# EasyEDA Pro project ProPrj_T113最小系统(最简)_2026-08-06.epro, schematic Schematic1

## Sheets
1 P1: Board Name: Board1; Create Date: 2026-06-25; Page Name: P1; Project Name: T113最小系统(最简); Schematic Name: Schematic1; Update Date: 2026-07-01; Company: 嘉立创EDA; Page Size: A4; Version: V1.0
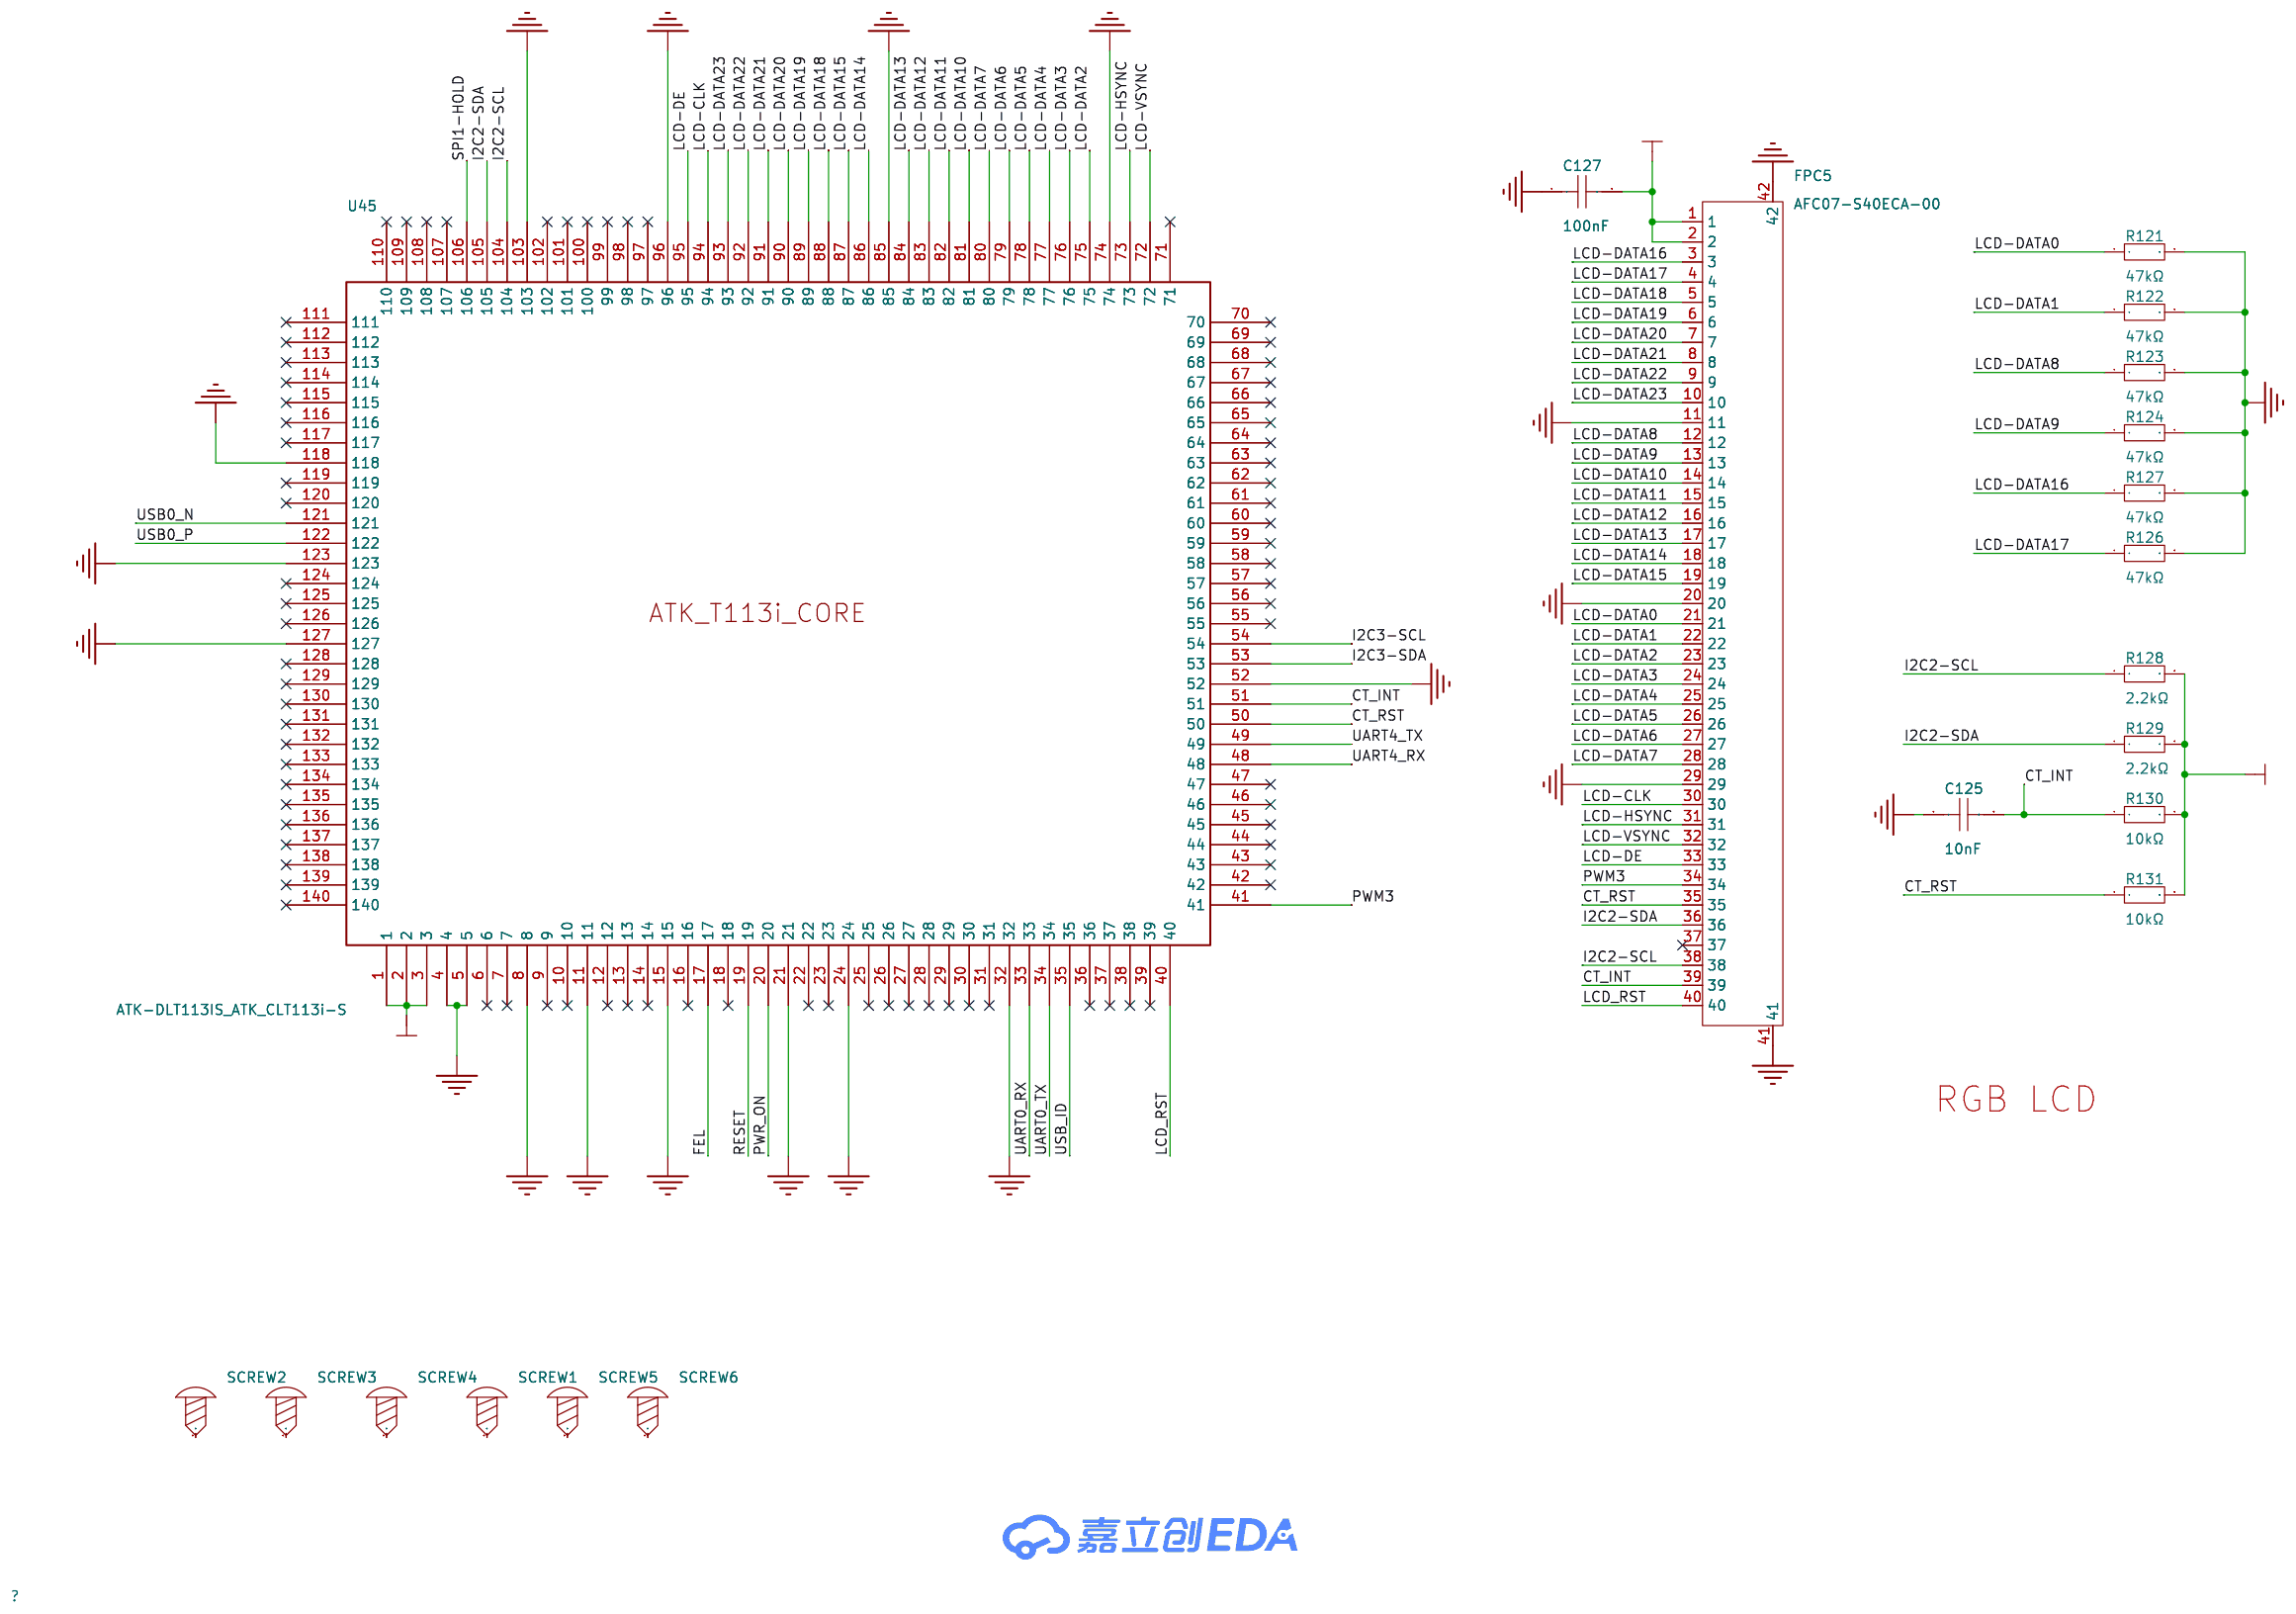
[diagram p0: P1]
2 P4: Page Name: P4; Update Date: 2026-06-25
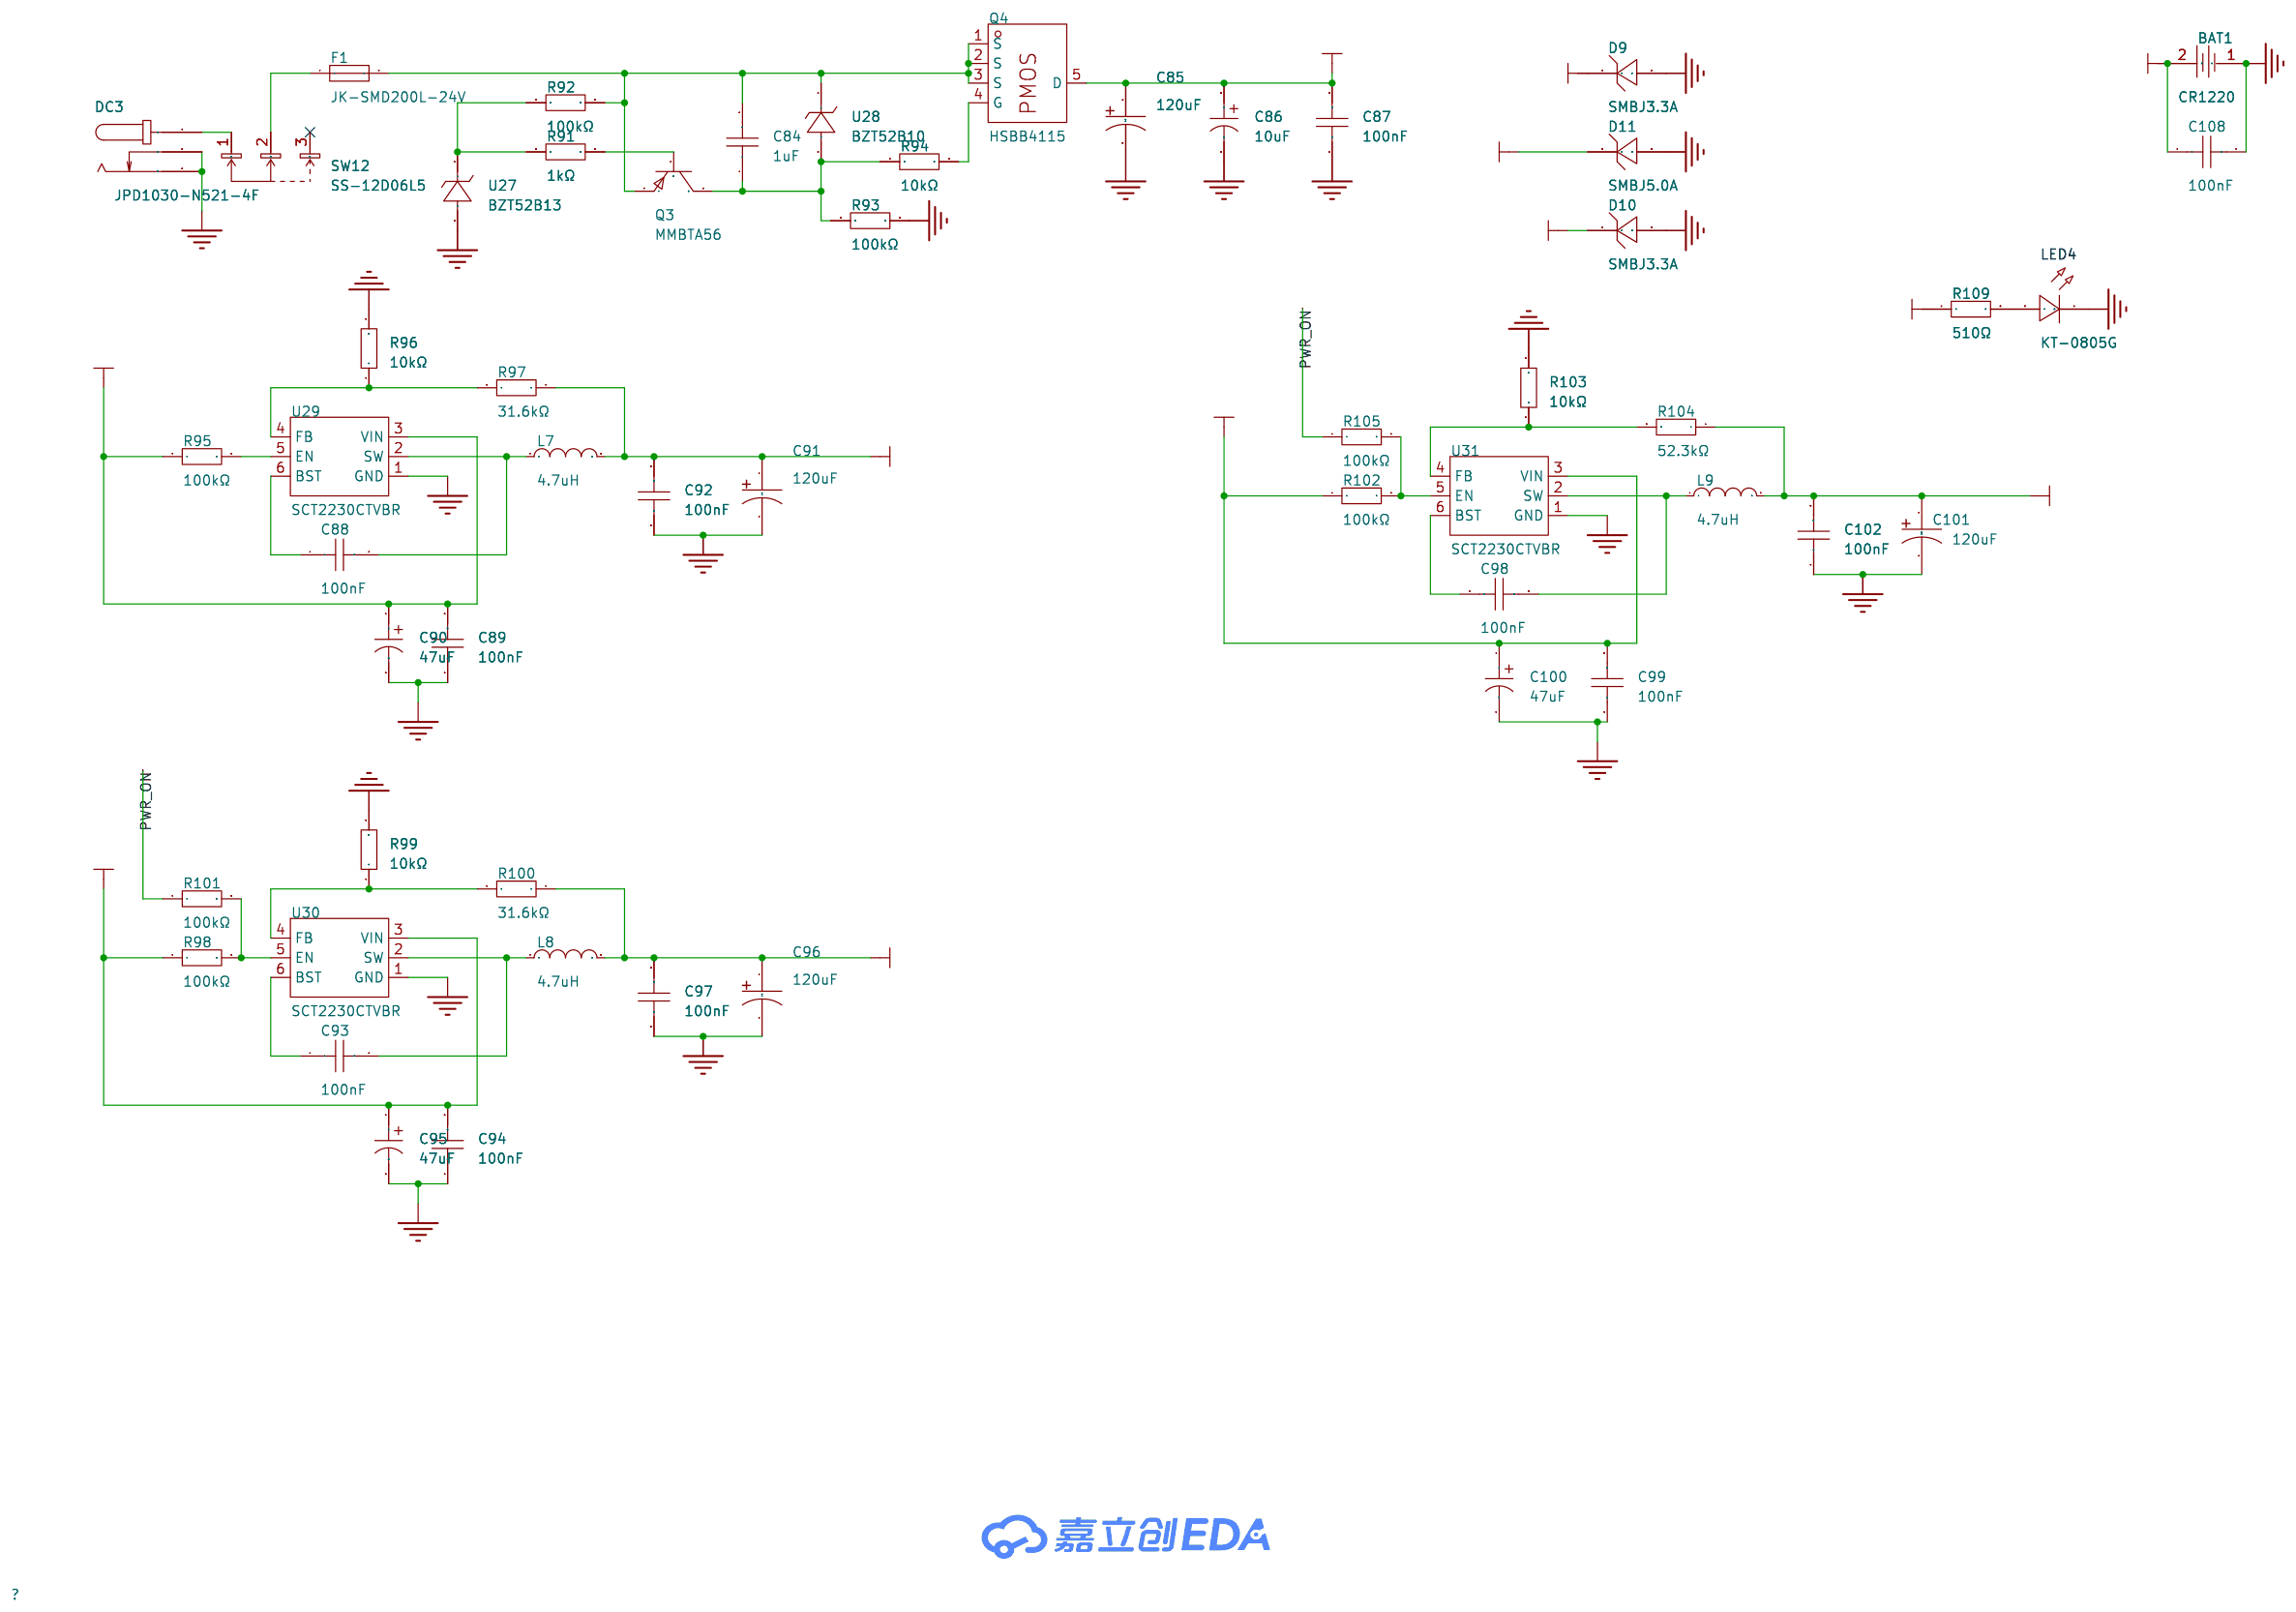
[diagram p1: P4]
3 P5: Page Name: P5; Update Date: 2026-06-25
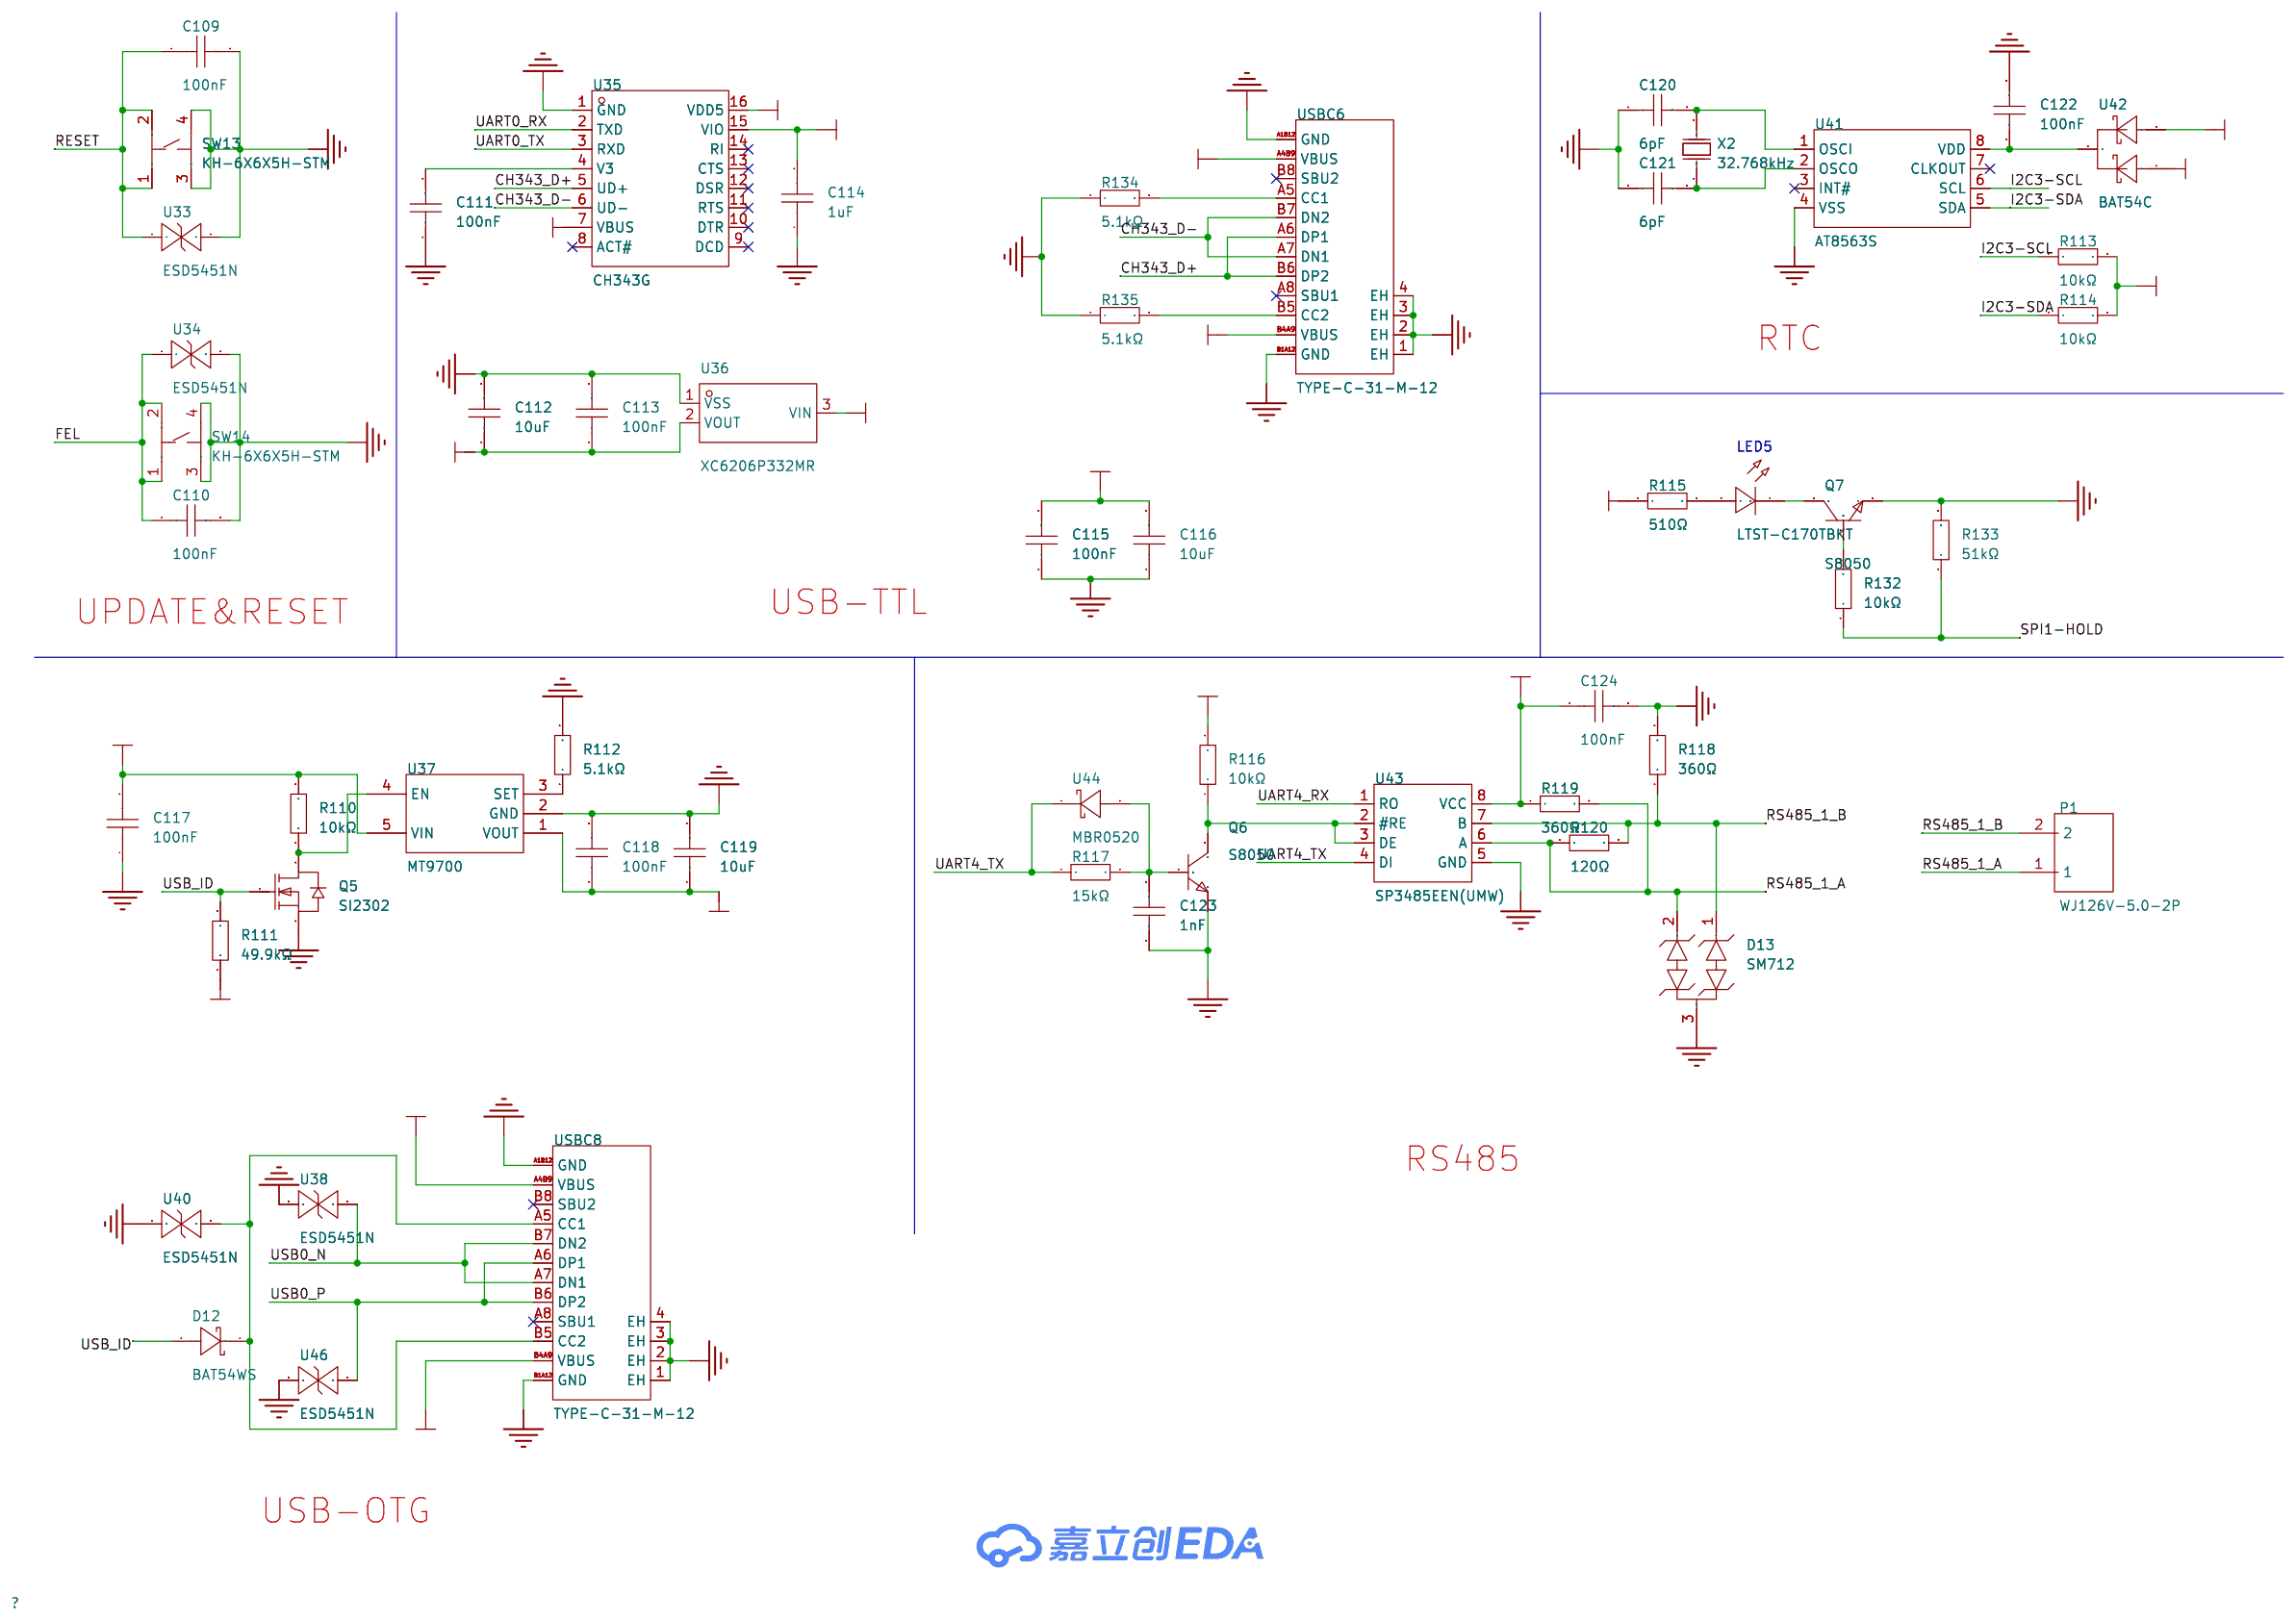
[diagram p2: P5]

## Parts
sheet P1
C125  10nF  [C0805]
C127  100nF  [C0805]
FPC5  AFC07-S40ECA-00  [FPC-SMD_P0.50-40P_LCS-SJ-H2.0]
R121  47kΩ  [R0805]
R122  47kΩ  [R0805]
R123  47kΩ  [R0805]
R124  47kΩ  [R0805]
R126  47kΩ  [R0805]
R127  47kΩ  [R0805]
R128  2.2kΩ  [R0805]
R129  2.2kΩ  [R0805]
R130  10kΩ  [R0805]
R131  10kΩ  [R0805]
SCREW1  -  [M3螺丝]
SCREW2  -  [M3螺丝]
SCREW3  -  [M3螺丝]
SCREW4  -  [M3螺丝]
SCREW5  -  [M3螺丝]
SCREW6  -  [M3螺丝]
U45  ATK_CLT113i-S  [ATK-DLT113IS:ATK_CLT113i_CORE]
sheet P4
BAT1  CR1220  [TH_BD12.5-P12.0-RD-CR1220]
C84  1uF  [C0805]
C85  120uF  [CAP-SMD_BD6.3-L6.6-W6.6-FD]
C86  10uF  [CAP-SMD_BD4.0-L4.3-W4.3-LS5.0-FD]
C87  100nF  [C0805]
C88  100nF  [C0805]
C89  100nF  [C0805]
C90  47uF  [CAP-SMD_BD6.3-L6.6-W6.6-LS7.2-FD]
C91  120uF  [CAP-SMD_BD6.3-L6.6-W6.6-FD]
C92  100nF  [C0805]
C93  100nF  [C0805]
C94  100nF  [C0805]
C95  47uF  [CAP-SMD_BD6.3-L6.6-W6.6-LS7.2-FD]
C96  120uF  [CAP-SMD_BD6.3-L6.6-W6.6-FD]
C97  100nF  [C0805]
C98  100nF  [C0805]
C99  100nF  [C0805]
C100  47uF  [CAP-SMD_BD6.3-L6.6-W6.6-LS7.2-FD]
C101  120uF  [CAP-SMD_BD6.3-L6.6-W6.6-FD]
C102  100nF  [C0805]
C108  100nF  [C0805]
D9  SMBJ3.3A  [SMB_L4.6-W3.6-LS5.3-RD]
D10  SMBJ3.3A  [SMB_L4.6-W3.6-LS5.3-RD]
D11  SMBJ5.0A  [SMB_L4.6-W3.6-LS5.3-RD]
DC3  JPD1030-N521-4F  [DC-IN-TH_JPD1030-N521-4F]
F1  JK-SMD200L-24V  [F2920]
L7  4.7uH  [IND-SMD_L4.6-W4.1-A]
L8  4.7uH  [IND-SMD_L4.6-W4.1-A]
L9  4.7uH  [IND-SMD_L4.6-W4.1-A]
LED4  KT-0805G  [LED0805-R-RD]
Q3  MMBTA56  [SOT-23-3_L2.9-W1.3-P1.90-LS2.4-BL-1]
Q4  HSBB4115  [DFN-8_L3.0-W3.0-P0.65-BL-1]
R91  1kΩ  [R0805]
R92  100kΩ  [R0805]
R93  100kΩ  [R0805]
R94  10kΩ  [R0805]
R95  100kΩ  [R0805]
R96  10kΩ  [R0805]
R97  31.6kΩ  [R0805]
R98  100kΩ  [R0805]
R99  10kΩ  [R0805]
R100  31.6kΩ  [R0805]
R101  100kΩ  [R0805]
R102  100kΩ  [R0805]
R103  10kΩ  [R0805]
R104  52.3kΩ  [R0805]
R105  100kΩ  [R0805]
R109  510Ω  [R0805]
SW12  SS-12D06L5  [SW-TH_3P-P4.70_L11.1-W12.7]
U27  BZT52B13  [SOD-123_L2.7-W1.6-LS3.7-RD]
U28  BZT52B10  [SOD-123_L2.7-W1.6-LS3.7-RD]
U29  SCT2230CTVBR  [TSOT-23-6_L2.9-W1.6-P0.95-LS2.8-BL]
U30  SCT2230CTVBR  [TSOT-23-6_L2.9-W1.6-P0.95-LS2.8-BL]
U31  SCT2230CTVBR  [TSOT-23-6_L2.9-W1.6-P0.95-LS2.8-BL]
sheet P5
C109  100nF  [C0805]
C110  100nF  [C0805]
C111  100nF  [C0805]
C112  10uF  [C0805]
C113  100nF  [C0805]
C114  1uF  [C0805]
C115  100nF  [C0805]
C116  10uF  [C0805]
C117  100nF  [C0805]
C118  100nF  [C0805]
C119  10uF  [C0805]
C120  6pF  [C0805]
C121  6pF  [C0805]
C122  100nF  [C0805]
C123  1nF  [C0805]
C124  100nF  [C0805]
D12  BAT54WS  [SOD-323_L1.7-W1.3-LS2.6-RD-1]
D13  SM712  [SOT-23-3_L2.9-W1.3-P1.90-LS2.4-BR]
LED5  LTST-C170TBKT  [LED0805-RD_BLUE]
P1  WJ126V-5.0-2P  [CONN-TH_WJ126V-5.0-2P]
Q5  SI2302  [SOT-23-3_L2.9-W1.3-P1.90-LS2.4-BR]
Q6  S8050  [SOT-23-3_L2.9-W1.3-P1.90-LS2.3-BR]
Q7  S8050  [SOT-23-3_L2.9-W1.3-P1.90-LS2.4-BR]
R110  10kΩ  [R0805]
R111  49.9kΩ  [R0805]
R112  5.1kΩ  [R0805]
R113  10kΩ  [R0805]
R114  10kΩ  [R0805]
R115  510Ω  [R0805]
R116  10kΩ  [R0805]
R117  15kΩ  [R0805]
R118  360Ω  [R0805]
R119  360Ω  [R0805]
R120  120Ω  [R0805]
R132  10kΩ  [R0805]
R133  51kΩ  [R0805]
R134  5.1kΩ  [R0805]
R135  5.1kΩ  [R0805]
SW13  KH-6X6X5H-STM  [SW-SMD_4P-L6.0-W6.0-P4.50-LS9.0_H5.0]
SW14  KH-6X6X5H-STM  [SW-SMD_4P-L6.0-W6.0-P4.50-LS9.0_H5.0]
U33  ESD5451N  [X1-DFN1006-2_L1.0-W0.6-P0.65-BI]
U34  ESD5451N  [X1-DFN1006-2_L1.0-W0.6-P0.65-BI]
U35  CH343G  [SOP-16_L10.0-W3.9-P1.27-LS6.0-BL]
U36  XC6206P332MR  [SOT-23-3_L3.0-W1.7-P0.95-LS2.9-BR]
U37  MT9700  [SOT-23-5_L3.0-W1.7-P0.95-LS2.8-BR]
U38  ESD5451N  [X1-DFN1006-2_L1.0-W0.6-P0.65-BI]
U40  ESD5451N  [X1-DFN1006-2_L1.0-W0.6-P0.65-BI]
U41  AT8563S  [MSOP-8_L3.0-W3.0-P0.65-LS5.0-BL]
U42  BAT54C  [SOT-23-3_L2.9-W1.3-P1.90-LS2.8-BR]
U43  SP3485EEN(UMW)  [SOP-8_L5.0-W4.0-P1.27-LS6.0-BL]
U44  MBR0520  [SOD-123_L2.7-W1.6-LS3.7-RD-A]
U46  ESD5451N  [X1-DFN1006-2_L1.0-W0.6-P0.65-BI]
USBC6  TYPE-C-31-M-12  [USB-C_SMD-TYPE-C-31-M-12_1]
USBC8  TYPE-C-31-M-12  [USB-C_SMD-TYPE-C-31-M-12_1]
X2  32.768kHz  [CRYSTAL-SMD_L3.2-W1.5-1]

## Library data of the parts
C125 = CL21B103KBANNNC: 容值:10nF;精度:±10%;额定电压:50V;温度系数:X7R;; LCSC Part Name: 10nF ±10% 50V; Supplier Part: C1710; Manufacturer: SAMSUNG(三星); Supplier Footprint: 0805; JLCPCB Part Class: Basic Part; Datasheet: https://item.szlcsc.com/datasheet/CL21B103KBANNNC/2062.html; Supplier: LCSC; Tolerance: ±10%; Voltage Rating: 50V; Temperature Coefficient: X7R
C87-C89 C92-C94 C97-C99 C102 C108-C111 C113 C115 C117 C118 C122 C124 C127 = CC0805KRX7R9BB104: 容值:100nF;精度:±10%;额定电压:50V;温度系数:X7R;; LCSC Part Name: 100nF ±10% 50V; Supplier Part: C49678; Manufacturer: YAGEO(国巨); Supplier Footprint: 0805; JLCPCB Part Class: Basic Part; Datasheet: https://atta.szlcsc.com/upload/public/pdf/source/20180224/C181747_15194369449651363981.pdf; Supplier: LCSC; Tolerance: ±10%; Voltage Rated: 50V; Temperature Coefficient: X7R; Voltage Rating: 50V
FPC5 = AFC07-S40ECA-00: 锁定特性:抽屉式;触点类型:上接;触点数量:40P;间距:0.5mm;安装方式:卧贴;; LCSC Part Name: 间距:0.5mm P数:40P 抽屉式 上接; Supplier Part: C262648; Manufacturer: JS(钜硕电子); Supplier Footprint: SMD,P=0.5mm,卧贴; JLCPCB Part Class: 扩展库; Datasheet: https://item.szlcsc.com/datasheet/AFC07-S40ECA-00/253907.html; Supplier: LCSC; Locking Feature: 抽屉式; Contact Type: 上接; Number of Contacts: 40P; Pitch: 0.5mm; Mounting Type: 卧贴; FFC, FCB Thickness: 0.3mm; Height Above Board: 2mm
R121-R124 R126 R127 = 0805W8F4702T5E: 电阻类型:厚膜电阻;阻值:47kΩ;精度:±1%;功率:125mW;工作电压:150V;温度系数:±100ppm/℃;; LCSC Part Name: 47kΩ ±1% 125mW 厚膜电阻; Supplier Part: C17713; Manufacturer: UNI-ROYAL(厚声); Supplier Footprint: 0805; JLCPCB Part Class: Basic Part; Datasheet: https://item.szlcsc.com/datasheet/0805W8F4702T5E/18401.html; Supplier: LCSC; Type: 厚膜电阻; Tolerance: ±1%; Power(Watts): 125mW; Voltage-Supply(Max): 150V; Temperature Coefficient: ±100ppm/℃; Operating Temperature: -55℃~+155℃
R128 R129 = 0805W8F2201T5E: 电阻类型:厚膜电阻;阻值:2.2kΩ;精度:±1%;功率:125mW;工作电压:150V;温度系数:±100ppm/℃;; LCSC Part Name: 2.2kΩ ±1% 125mW 厚膜电阻; Supplier Part: C17520; Manufacturer: UNI-ROYAL(厚声); Supplier Footprint: 0805; JLCPCB Part Class: Basic Part; Datasheet: https://item.szlcsc.com/datasheet/0805W8F2201T5E/18208.html; Supplier: LCSC; Type: 厚膜电阻; Tolerance: ±1%; Power(Watts): 125mW; Voltage-Supply(Max): 150V; Temperature Coefficient: ±100ppm/℃; Operating Temperature: -55℃~+155℃
R94 R96 R99 R103 R110 R113 R114 R116 R130-R132 = 0805W8F1002T5E_C17414: 电阻类型:厚膜电阻;阻值:10kΩ;精度:±1%;功率:125mW;工作电压:150V;温度系数:±100ppm/℃;; LCSC Part Name: 10kΩ ±1% 125mW 厚膜电阻; Supplier Part: C17414; Manufacturer: UNI-ROYAL(厚声); Manufacturer Part: 0805W8F1002T5E; Supplier Footprint: 0805; JLCPCB Part Class: Basic Part; Datasheet: https://atta.szlcsc.com/upload/public/pdf/source/20200306/C422600_1E6D84923E4A46A82E41ADD87F860B5C.pdf; Supplier: LCSC; Type: 厚膜电阻; Tolerance: ±1%; Power(Watts): 125mW; Voltage-Supply(Max): 150V; Temperature Coefficient: ±100ppm/℃; Operating Temperature: -55℃~+155℃
SCREW1-SCREW6 = M3螺丝: Supplier Footprint: 插件
U45 = ATK-DLT113IS_ATK_CLT113i-S: Check: true
BAT1 = CR1220: CR1220 卧式插脚一体式钮扣电池 直接插件安装 DIP 连接器类型：电池+焊脚一体式 电池规格：CR1220 电压：3V 容量：40mAH 直径：12.5MM 厚度：2MM; LCSC Part Name: LX(连欣科技) 锂锰电池 3V 40mAh 1个; Supplier Part: C21882464; Manufacturer: LX(连欣科技); JLCPCB Part Class: 扩展库; Datasheet: https://item.szlcsc.com/datasheet/CR1220/23311122.html; Supplier: LCSC
C84 C114 = CL21B105KBFNNNE: 容值:1uF;精度:±10%;额定电压:50V;温度系数:X7R;; LCSC Part Name: 1uF ±10% 50V; Supplier Part: C28323; Manufacturer: SAMSUNG(三星); Supplier Footprint: 0805; JLCPCB Part Class: Basic Part; Datasheet: https://item.szlcsc.com/datasheet/CL21B105KBFNNNE/29074.html; Supplier: LCSC; Tolerance: ±10%; Voltage Rated: 50V; Temperature Coefficient: X7R; Voltage Rating: 50V
C85 C91 C96 C101 = 20SVPF120M: 容值:120uF;精度:±20%;额定电压:20V;纹波电流:160mA@120Hz;等效串联电阻:25mΩ;类型:聚合物;; LCSC Part Name: 120uF ±20% 20V; Supplier Part: C186713; Manufacturer: PANASONIC(松下); Supplier Footprint: SMD,D6.3xL5.9mm; JLCPCB Part Class: 扩展库; Datasheet: https://atta.szlcsc.com/upload/public/pdf/source/20180327/C189474_7AF514A7211A8C739D06064A6F8399AC.pdf; Supplier: LCSC; Tolerance: ±20%; Rated Voltage: 20V; Ripple Current: 160mA@120Hz; Equivalent Series Resistance(ESR): 25mΩ; Type: 聚合物; φD: 6.3mm; L: 5.9mm; Lifetime @ Temp: 5000hrs@105℃; Operating Temperature: -55℃~+105℃
C86 = RVT1E100M0405 10UF 25V: 容值:10uF;精度:±20%;额定电压:25V;纹波电流:15mA@120Hz;等效串联电阻(ESR):-;; LCSC Part Name: 10uF ±20% 25V; Supplier Part: C970655; Manufacturer: DMBJ(振宝佳); Supplier Footprint: SMD,D4xL5.4mm; JLCPCB Part Class: 扩展库; Datasheet: https://item.szlcsc.com/datasheet/RVT1E100M0405%252010UF%252025V/1060383.html; Supplier: LCSC; Tolerance: ±20%; Voltage Rating: 25V; Ripple Current: 15mA@120Hz; Diameter: 4mm; Height - Seated (Max): 5.4mm; Lifetime: 2800hrs@105℃; Operating Temperature: -55℃~+105℃
C90 C95 C100 = RVT1E470M0605 47UF 25V: 容值:47uF;精度:±20%;额定电压:25V;纹波电流:49mA@120Hz;等效串联电阻(ESR):-;; LCSC Part Name: 47uF ±20% 25V; Supplier Part: C970677; Manufacturer: DMBJ(振宝佳); Supplier Footprint: SMD,D6.3xL5.4mm; JLCPCB Part Class: 扩展库; Datasheet: https://item.szlcsc.com/datasheet/RVT1E470M0605%252047UF%252025V/1060405.html; Supplier: LCSC; Tolerance: ±20%; Voltage Rating: 25V; Ripple Current: 49mA@120Hz; Diameter: 6.3mm; Height - Seated (Max): 5.4mm; Lifetime: 2800hrs@105℃; Operating Temperature: -55℃~+105℃
D9 D10 = SMBJ3.3A_C19077556: 极性:单向;反向截止电压(Vrwm):3.3V;钳位电压:8V;峰值脉冲电流(Ipp):75A@10/1000us;峰值脉冲功率(Ppp):600W@10/1000us;击穿电压:6.5V;; LCSC Part Name: 单向TVS 3.3V截止 峰值浪涌电流：75A@10/1000us; Supplier Part: C19077556; Manufacturer: R+O(宏嘉诚); Supplier Footprint: DO-214AA(SMB); JLCPCB Part Class: 扩展库; Datasheet: https://item.szlcsc.com/datasheet/SMBJ3.3A/20275641.html; Supplier: LCSC; Polarity: 单向; Reverse Stand-Off Voltage (Vrwm): 3.3V; Clamping Voltage: 8V; Peak Pulse Current (Ipp): 75A@10/1000us; Peak Pulse Power Dissipation (Ppp): 600W@10/1000us; Voltage - Breakdown: 6.5V; Reverse Leakage Current (Ir): 600uA; Operating Temperature: -55℃~+150℃; level of protection: IEC 61000-4-2; Type: TVS
D11 = SMBJ5.0A_C83333: 反向截止电压(Vrwm):5V;钳位电压:9.2V;峰值脉冲电流(Ipp):65.3A;峰值脉冲功率(Ppp):600W;击穿电压:6.4V;; Supplier Part: C83333; Manufacturer: Littelfuse(美国力特); Supplier Footprint: DO-214AA; JLCPCB Part Class: 扩展库; Datasheet: https://atta.szlcsc.com/upload/public/pdf/source/20180622/C83333_54A96CB13F34736FC2597463A926577F.pdf; Supplier: LCSC; Reverse Stand-Off Voltage (Vrwm): 5V; Clamping Voltage: 9.2V; Peak Pulse Current (Ipp): 65.3A; Peak Pulse Power Dissipation (Ppp): 600W; Voltage - Breakdown: 6.4V; Type: TVS
DC3 = JPD1030-N521-4F: 连接器类型:DC电源插座;安装方式:弯插;触点内径:-;触点外径:-;额定电流:5A;额定电压:20V;工作温度范围:-25℃~+70℃;; LCSC Part Name: DC电源插座; Supplier Part: C426213; Manufacturer: FOXCONN(富士康); Supplier Footprint: 插件; JLCPCB Part Class: Extended Part; Datasheet: https://atta.szlcsc.com/upload/public/pdf/source/20190911/C426213_6D3C53863786FAD5F91985EAA29E84FC.pdf; Supplier: LCSC; Connector Type: DC电源插座; Mounting Style: 弯插; Current Rating (Max): 5A; Voltage Rating (Max): 20V; Operating Temperature Range: -25℃~+70℃
F1 = JK-SMD200L-24V: 耐压(Vmax):24V;最大电流(Imax):100A;保持电流(Ihold):2A;跳闸电流(Itrip):4A;; LCSC Part Name: 24V 2A 2920自恢复; Supplier Part: C692154; Manufacturer: JK(金科); Supplier Footprint: 2920; JLCPCB Part Class: 扩展库; Datasheet: https://item.szlcsc.com/datasheet/JK-SMD200L-24V/724587.html; Supplier: LCSC; Voltage - Max: 24V; Current - Max: 100A; Hold Current: 2A; Trip Current: 4A; Power Dissipation: 1.5W; Resistance - Initial (Ri) (Min): 20mΩ; Resistance - Post Trip (R1) (Max): 120mΩ; Time to Trip(Max): 4.5s; Operating Temperature: -40℃~+85℃
L7-L9 = SRG0420-4R7-M: 电感值:4.7uH;精度:±20%;额定电流:3A;饱和电流(Isat):3.5A;类型:一体成型电感;; LCSC Part Name: 4.7μH ±20% 3.5A; Supplier Part: C53462918; Manufacturer: JIERR(捷而瑞); Supplier Footprint: SMD,4.6x4.1mm; JLCPCB Part Class: 扩展库; Datasheet: https://item.szlcsc.com/datasheet/SRG0420-4R7-M/56628163.html; Supplier: LCSC; Tolerance: ±20%; Current Rating: 3A; Current - Saturation(Isat): 3.5A; DC Resistance(DCR): 105mΩ; Type: 一体成型电感
LED4 = KT-0805G: 灯头类型:-;发光颜色:翠绿色;正向压降(Vf):2.6V~3.1V;功率:100mW;正向电流:5mA;波长:513nm~528nm;二极管配置:独立二极管;透镜颜色:无色透明透镜;色温:-;发光强度:430mcd;发光角度:120°;载带方式:-;工作温度:-40℃~+85℃;; LCSC Part Name: 0805 翠绿 高亮; Supplier Part: C2297; Manufacturer: KENTO; Supplier Footprint: 0805; JLCPCB Part Class: Basic Part; Datasheet: https://item.szlcsc.com/datasheet/KT-0805G/2670.html; Supplier: LCSC; Illumination Color: 翠绿色; Voltage - Forward(Vf): 2.6V~3.1V; Power(Watts): 100mW; Forward Current: 5mA; Wavelength - Dominant: 513nm~528nm; Peak Wavelength: 525nm; Diode Configuration: 独立二极管; Lens Color: 无色透明透镜; Luminous Intensity: 430mcd; Viewing Angle: 120°; Operating Temperature: -40℃~+85℃
Q3 = MMBTA56_C20069147: 晶体管类型:PNP;集电极电流(Ic):500mA;集射极击穿电压(Vceo):80V;耗散功率(Pd):225mW;直流电流增益(hFE):100;; LCSC Part Name: hFE:100-400 PNP 电流:0.5A 电压:80V; Supplier Part: C20069147; Manufacturer: R+O(宏嘉诚); Supplier Footprint: SOT-23; JLCPCB Part Class: 扩展库; Datasheet: https://item.szlcsc.com/datasheet/MMBTA56/21397185.html; Supplier: LCSC; type: PNP; Current - Collector(Ic): 500mA; Collector - Emitter Voltage VCEO: 80V; Pd - Power Dissipation: 225mW; DC Current Gain: 100; Transition frequency(fT): 50MHz; Current - Collector Cutoff: 100nA; Vce Saturation(VCE(sat)): 250mV; Operating Temperature: -55℃~+150℃; Emitter-Base Voltage(Vebo): 4V; Number: 1个PNP
Q4 = HSBB4115: 数量:1个P沟道;漏源电压(Vdss):40V;连续漏极电流(Id):39A;导通电阻(RDS(on)):13mΩ@10V;耗散功率(Pd):52.1W;阈值电压(Vgs(th)):2.5V@250uA;; LCSC Part Name: 1个P沟道 耐压:40V 电流:39A; Supplier Part: C2828497; Manufacturer: HUASHUO(华朔); Supplier Footprint: PRPAK3x3-8L; JLCPCB Part Class: 扩展库; Datasheet: https://item.szlcsc.com/datasheet/HSBB4115/2976501.html; Supplier: LCSC; Number: 1个P沟道; Drain to Source Voltage: 40V; Current - Continuous Drain(Id): 39A; RDS(on): 13mΩ@10V; Pd - Power Dissipation: 52.1W; Gate Threshold Voltage (Vgs(th)): 2.5V@250uA; Gate Charge(Qg): 27.9nC@4.5V; Input Capacitance(Ciss): 3.5nF; Reverse Transfer Capacitance (Crss@Vds): 222pF@15V; Operating Temperature: -55℃~+150℃; Type: P沟道
R91 = 0805W8F1001T5E: 电阻类型:厚膜电阻;阻值:1kΩ;精度:±1%;功率:125mW;最大工作电压:150V;温度系数:±100ppm/℃;; LCSC Part Name: 1kΩ ±1% 125mW 厚膜电阻; Supplier Part: C17513; Manufacturer: UNI-ROYAL(厚声); Supplier Footprint: 0805; JLCPCB Part Class: Basic Part; Datasheet: https://atta.szlcsc.com/upload/public/pdf/source/20200306/C422600_1E6D84923E4A46A82E41ADD87F860B5C.pdf; Supplier: LCSC; Type: 厚膜电阻; Tolerance: ±1%; Power(Watts): 125mW; Overload Voltage (Max): 150V; Temperature Coefficient: ±100ppm/℃; Operating Temperature Range: -55℃~+155℃
R92 R93 R95 R98 R101 R102 R105 = 0805W8F1003T5E: 电阻类型:厚膜电阻;阻值:100kΩ;精度:±1%;功率:125mW;工作电压:150V;温度系数:±100ppm/℃;; LCSC Part Name: 100kΩ ±1% 125mW 厚膜电阻; Supplier Part: C149504; Manufacturer: UNI-ROYAL(厚声); Supplier Footprint: 0805; JLCPCB Part Class: Basic Part; Datasheet: https://atta.szlcsc.com/upload/public/pdf/source/20200306/C422600_1E6D84923E4A46A82E41ADD87F860B5C.pdf; Supplier: LCSC; Type: 厚膜电阻; Tolerance: ±1%; Power(Watts): 125mW; Voltage-Supply(Max): 150V; Temperature Coefficient: ±100ppm/℃; Operating Temperature: -55℃~+155℃
R97 R100 = FRC0805F3162TS: 电阻类型:厚膜电阻;阻值:31.6kΩ;精度:±1%;功率:125mW;工作电压:150V;温度系数:±100ppm/℃;; LCSC Part Name: 31.6kΩ ±1% 125mW 厚膜电阻; Supplier Part: C2930156; Manufacturer: FOJAN(富捷); Supplier Footprint: 0805; JLCPCB Part Class: Extended Part; Datasheet: https://item.szlcsc.com/datasheet/FRC0805F3162TS/3267089.html; Supplier: LCSC; Type: 厚膜电阻; Tolerance: ±1%; Power(Watts): 125mW; Voltage-Supply(Max): 150V; Temperature Coefficient: ±100ppm/℃; Operating Temperature: -55℃~+155℃
R104 = ARG05BTC5232: 电阻类型:薄膜电阻;阻值:52.3kΩ;精度:±0.1%;功率:125mW;工作电压:150V;温度系数:±25ppm/℃;; LCSC Part Name: 薄膜电阻 52.3kΩ ±0.1% 125mW; Supplier Part: C2758300; Manufacturer: Viking(光颉); Supplier Footprint: 0805; JLCPCB Part Class: Extended Part; Datasheet: https://item.szlcsc.com/datasheet/ARG05BTC5232/2876134.html; Supplier: LCSC; Type: 薄膜电阻; Tolerance: ±0.1%; Power(Watts): 125mW; Voltage-Supply(Max): 150V; Temperature Coefficient: ±25ppm/℃; Operating Temperature: -55℃~+155℃
R109 R115 = 0805W8F5100T5E: 电阻类型:厚膜电阻;阻值:510Ω;精度:±1%;功率:125mW;工作电压:150V;温度系数:±100ppm/℃;; LCSC Part Name: 510Ω ±1% 125mW 厚膜电阻; Supplier Part: C17734; Manufacturer: UNI-ROYAL(厚声); Supplier Footprint: 0805; JLCPCB Part Class: Basic Part; Datasheet: https://item.szlcsc.com/datasheet/0805W8F5100T5E/18422.html; Supplier: LCSC; Type: 厚膜电阻; Tolerance: ±1%; Power(Watts): 125mW; Overload Voltage (Max): 150V; Temperature Coefficient: ±100ppm/℃; Operating Temperature Range: -55℃~+155℃; Voltage-Supply(Max): 150V; Operating Temperature: -55℃~+155℃
SW12 = SS-12D06L5: 电路结构:单刀双掷;安装方式:-;开关颜色:黑色;额定电流:3A;额定电压:125V;工作寿命:1万次;; LCSC Part Name: 柄长5mm 卧插双档 滑动开关; Supplier Part: C319015; Manufacturer: XKB Connection(中国星坤); Supplier Footprint: 插件,13x6.6mm; JLCPCB Part Class: 扩展库; Supplier: LCSC; Circuit: 单刀双掷; Actuator Style: 矩形柱状; Termination Style: PC引脚; Length: 12.95mm; Width: 6.6mm; Switch Height: 6.3mm; Actuator Color: 黑色; Current Rating: 3A; Voltage Rating: 125V; Life: 1万次; Operating Temperature: -40℃~+85℃
U27 = BZT52B13_C22399883: 二极管配置:独立式;稳压值(标称值):13V;稳压值(范围):12.74V~13.26V;耗散功率(Pd):500mW;; LCSC Part Name: 独立式 耐压:13V 电流:0.1uA@8V; Supplier Part: C22399883; Manufacturer: R+O(宏嘉诚); Supplier Footprint: SOD-123; JLCPCB Part Class: 扩展库; Datasheet: https://item.szlcsc.com/datasheet/BZT52B13/24018225.html; Supplier: LCSC; Diode Configuration: 独立式; Zener Voltage(Nom): 13V; Reverse Leakage Current (Ir): 100nA@8V; Zener Voltage(Range): 12.74V~13.26V; Pd - Power Dissipation: 500mW; Impedance(Zzt): 30Ω; Impedance(Zzk): 170Ω; Operating Junction Temperature Range: -55℃~+150℃
U28 = BZT52B10_C22395568: 二极管配置:独立式;稳压值(标称值):10V;稳压值(范围):9.8V~10.2V;耗散功率(Pd):500mW;; LCSC Part Name: 独立式 耐压:10V 电流:0.2uA@7V; Supplier Part: C22395568; Manufacturer: R+O(宏嘉诚); Supplier Footprint: SOD-123; JLCPCB Part Class: 扩展库; Datasheet: https://item.szlcsc.com/datasheet/BZT52B10/23994565.html; Supplier: LCSC; Diode Configuration: 独立式; Zener Voltage(Nom): 10V; Reverse Leakage Current (Ir): 200nA@7V; Zener Voltage(Range): 9.8V~10.2V; Pd - Power Dissipation: 500mW; Impedance(Zzt): 20Ω; Impedance(Zzk): 150Ω; Operating Junction Temperature Range: -55℃~+150℃
U29-U31 = SCT2230CTVBR: 功能类型:降压型;输出类型:可调;工作电压:4.2V~17V;输出电压:800mV~7V;输出电流:3A;; LCSC Part Name: 17V输入3A同步降压DC-DC转换器; Supplier Part: C2930979; Manufacturer: SCT(芯洲科技); Supplier Footprint: TSOT-23-6; JLCPCB Part Class: 扩展库; Datasheet: https://atta.szlcsc.com/upload/public/pdf/source/20211220/B2F328712B967C0C2C7A75870BD00302.pdf; Supplier: LCSC; Function: 降压型; Output Type: 可调; Voltage - Supply: 4.2V~17V; Output Voltage: 800mV~7V; Output Current: 3A; Frequency - Switching: 750kHz; Operating Temperature: -40℃~+125℃; Synchronous Rectifier: 是; Number of Outputs: 1; Topology: 降压式; Quiescent Current: 135uA; Switch tube (built-in/external): 内置
C112 C116 C119 = CL21A106KAYNNNE_C15850: 容值:10uF;精度:±10%;额定电压:25V;温度系数:X5R;; LCSC Part Name: 10uF ±10% 25V; Supplier Part: C15850; Manufacturer: SAMSUNG(三星); Manufacturer Part: CL21A106KAYNNNE; Supplier Footprint: 0805; JLCPCB Part Class: Basic Part; Datasheet: https://atta.szlcsc.com/upload/public/pdf/source/20160218/1457707763339.pdf; Supplier: LCSC; Tolerance: ±10%; Voltage Rated: 25V; Temperature Coefficient: X5R; Voltage Rating: 25V
C120 C121 = 0805CG6R0C500NT: 容值:6pF;额定电压:50V;温度系数:C0G;; LCSC Part Name: ±0.25pF 6pF 50V; Supplier Part: C67560; Manufacturer: FH(风华); Supplier Footprint: 0805; JLCPCB Part Class: Extended Part; Datasheet: https://item.szlcsc.com/datasheet/0805CG6R0C500NT/68656.html; Supplier: LCSC; Voltage Rating: 50V; Temperature Coefficient: C0G
C123 = CL21B102KBCNNNC: 容值:1nF;精度:±10%;额定电压:50V;温度系数:X7R;; LCSC Part Name: 1nF ±10% 50V; Supplier Part: C46653; Manufacturer: SAMSUNG(三星); Supplier Footprint: 0805; JLCPCB Part Class: Basic Part; Datasheet: https://atta.szlcsc.com/upload/public/pdf/source/20160218/1457707763339.pdf; Supplier: LCSC; Tolerance: ±10%; Voltage Rated: 50V; Temperature Coefficient: X7R; Voltage Rating: 50V
D12 = BAT54WS_C7502694: 二极管配置:独立式;正向压降(Vf):1V@100mA;直流反向耐压(Vr):30V;整流电流:200mA;; LCSC Part Name: 电压:30V 电流:0.2A; Supplier Part: C7502694; Manufacturer: R+O(宏嘉诚); Supplier Footprint: SOD-323; JLCPCB Part Class: Extended Part; Datasheet: https://item.szlcsc.com/datasheet/BAT54WS/8589411.html; Supplier: LCSC; Diode Configuration: 独立式; Forward Voltage (Vf@If): 1V@100mA; Reverse Voltage (Vr): 30V; Rectified Current: 200mA; Reverse Leakage Current (Ir): 2uA; Voltage - Forward(Vf@If): 1V@100mA; Voltage - DC Reverse(Vr): 30V; Current - Rectified: 200mA; Operating Junction Temperature Range: -55℃~+125℃; Non-Repetitive Peak Forward Surge Current: 600A
D13 = SM712_C7420375: 极性:双向;反向截止电压(Vrwm):12V；7V;钳位电压:16V；26V;峰值脉冲电流(Ipp):12A;峰值脉冲功率(Ppp):300W;击穿电压:7.5V；13.5V;; LCSC Part Name: 丝印:7AM 双向ESD 7V 12V截止 峰值浪涌电流：12A; Supplier Part: C7420375; Manufacturer: R+O(宏嘉诚); Supplier Footprint: SOT-23; JLCPCB Part Class: 扩展库; Datasheet: https://item.szlcsc.com/datasheet/SM712/8397197.html; Supplier: LCSC; Polarity: 双向; Reverse Stand-Off Voltage (Vrwm): 12V；7V; Clamping Voltage: 16V；26V; Peak Pulse Current (Ipp): 12A; Peak Pulse Power Dissipation (Ppp): 300W; Voltage - Breakdown: 7.5V；13.5V; Reverse Leakage Current (Ir): 1uA；2uA; Number of Channels: 双路; Operating Temperature: -55℃~+125℃; level of protection: IEC 61000-4-5；IEC 61000-4-2; Type: ESD; Junction Capacitance: 75pF
LED5 = LTST-C170TBKT: 灯头类型:-;发光颜色:蓝色;正向压降(Vf):3.3V;功率:76mW;正向电流:20mA;波长:465nm~475nm;二极管配置:独立二极管;透镜颜色:无色透明透镜;色温:-;发光强度:104mcd;发光角度:130°;载带方式:-;工作温度:-20℃~+80℃;; LCSC Part Name: 蓝灯; Supplier Part: C98222; Manufacturer: LITEON(光宝); Supplier Footprint: 0805; JLCPCB Part Class: Extended Part; Datasheet: https://atta.szlcsc.com/upload/public/pdf/source/20171026/C98222_15089842934011059296.pdf; Supplier: LCSC; Emitted Color: 蓝色; Forward Voltage (VF): 3.3V; Power Dissipation: 76mW; Forward Current: 20mA; Dominant Wavelength: 465nm~475nm; Peak Wavelength: 468nm; Lens Color: 无色透明透镜; Luminous Intensity: 104mcd; Viewing Angle: 130°; Operating Temperature: -20℃~+80℃; Illumination Color: 蓝色; Voltage - Forward(Vf): 3.3V; Power(Watts): 76mW; Wavelength - Dominant: 465nm~475nm
P1 = WJ126V-5.0-2P: 结构:1x2P;间距:5mm;颜色:绿色;安装方式:直插;排数:1;每排PIN数:2;额定电流:18A;额定电压:250V;线规 - AWG:14~26;线规 - 平方毫米:2.5;工作温度:-40℃~+105℃;; LCSC Part Name: 5mm 1x2P 排数:1 每排P数:2 直插; Supplier Part: C8404; Manufacturer: KANGNEX(康奈克斯电气); Supplier Footprint: 插件,P=5mm; JLCPCB Part Class: 扩展库; Datasheet: https://item.szlcsc.com/datasheet/WJ126V-5.0-2P/8898.html; Supplier: LCSC; Number of Positions or Pins: 1x2P; Pitch: 5mm; Color: 绿色; Mounting Type: 直插; Number of Pins: 2P; Number of Rows: 1; Number of PINs Per Row: 2; Current Rating: 18A; Voltage Rating (Max): 250V; Wire Gauge - AWG: 14~26; Wire Gauge - mm2: 2.5; Operating Temperature: -40℃~+105℃
Q5 = SI2302_C2891732: 类型:1个N沟道;漏源电压(Vdss):20V;连续漏极电流(Id):3A;导通电阻(RDS(on)):50mΩ@4.5V,3A;耗散功率(Pd):1W;阈值电压(Vgs(th)):1V;; LCSC Part Name: N沟道,电流:3A,耐压:20V; Supplier Part: C2891732; Manufacturer: YONGYUTAI(永裕泰); Supplier Footprint: SOT-23; JLCPCB Part Class: 扩展库; Datasheet: https://atta.szlcsc.com/upload/public/pdf/source/20210901/467BBA277A18343FF82D7D641AA41F7C.pdf; Supplier: LCSC; Type: 1个N沟道; Drain to Source Voltage: 20V; Current - Continuous Drain(Id): 3A; RDS(on): 50mΩ@4.5V,3A; Pd - Power Dissipation: 1W; Gate Threshold Voltage (Vgs(th)@Id): 1V; Input Capacitance(Ciss@Vds): 300pF@10V; Reverse Transfer Capacitance (Crss@Vds): 80pF@10V; Operating Temperature: -55℃~+150℃
Q6 = S8050_C20069125: 晶体管类型:NPN;集电极电流(Ic):500mA;集射极击穿电压(Vceo):25V;耗散功率(Pd):300mW;直流电流增益(hFE):120@50mA,1.0V;; LCSC Part Name: hFE:200-350，丝印:J3Y NPN 500mA 25V; Supplier Part: C20069125; Manufacturer: R+O(宏嘉诚); Supplier Footprint: SOT-23; JLCPCB Part Class: 扩展库; Datasheet: https://item.szlcsc.com/datasheet/S8050/21397163.html; Supplier: LCSC; type: NPN; Current - Collector(Ic): 500mA; Collector - Emitter Voltage VCEO: 25V; Pd - Power Dissipation: 300mW; DC Current Gain: 120@50mA,1.0V; Transition frequency(fT): 100MHz; Current - Collector Cutoff: 100nA; Vce Saturation(VCE(sat)): 600mV@500mA,50mA; Operating Temperature: -55℃~+150℃; Emitter-Base Voltage(Vebo): 5V
Q7 = S8050: 晶体管类型:NPN;集电极电流(Ic):500mA;集射极击穿电压(Vceo):25V;耗散功率(Pd):300mW;直流电流增益(hFE):400@50mA,1V;; LCSC Part Name: NPN 电流:500mA 电压:25V; Supplier Part: C2931719; Manufacturer: Doeshare(德芯); Supplier Footprint: SOT-23; JLCPCB Part Class: 扩展库; Datasheet: https://item.szlcsc.com/datasheet/S8050/3273402.html; Supplier: LCSC; type: NPN; Current - Collector(Ic): 500mA; Collector - Emitter Voltage VCEO: 25V; Pd - Power Dissipation: 300mW; DC Current Gain: 400@50mA,1V; Transition frequency(fT): 150MHz; Current - Collector Cutoff: 100nA; Vce Saturation(VCE(sat)): 600mV@500mA,50mA; Emitter-Base Voltage(Vebo): 5V
R111 = 0805W8F4992T5E: 电阻类型:厚膜电阻;阻值:49.9kΩ;精度:±1%;功率:125mW;工作电压:150V;温度系数:±100ppm/℃;; LCSC Part Name: 49.9kΩ ±1% 125mW 厚膜电阻; Supplier Part: C17719; Manufacturer: UNI-ROYAL(厚声); Supplier Footprint: 0805; JLCPCB Part Class: Extended Part; Datasheet: https://atta.szlcsc.com/upload/public/pdf/source/20200306/C422600_1E6D84923E4A46A82E41ADD87F860B5C.pdf; Supplier: LCSC; Type: 厚膜电阻; Tolerance: ±1%; Power(Watts): 125mW; Overload Voltage (Max): 150V; Temperature Coefficient: ±100ppm/℃; Operating Temperature Range: -55℃~+155℃; Voltage-Supply(Max): 150V; Operating Temperature: -55℃~+155℃
R112 R134 R135 = 0805W8F5101T5E: 电阻类型:厚膜电阻;阻值:5.1kΩ;精度:±1%;功率:125mW;工作电压:150V;温度系数:±100ppm/℃;; LCSC Part Name: 5.1kΩ ±1% 125mW 厚膜电阻; Supplier Part: C27834; Manufacturer: UNI-ROYAL(厚声); Supplier Footprint: 0805; JLCPCB Part Class: Basic Part; Datasheet: https://atta.szlcsc.com/upload/public/pdf/source/20200306/C422600_1E6D84923E4A46A82E41ADD87F860B5C.pdf; Supplier: LCSC; Type: 厚膜电阻; Tolerance: ±1%; Power(Watts): 125mW; Overload Voltage (Max): 150V; Temperature Coefficient: ±100ppm/℃; Operating Temperature Range: -55℃~+155℃; Voltage-Supply(Max): 150V; Operating Temperature: -55℃~+155℃
R117 = 0805W8F1502T5E: 电阻类型:厚膜电阻;阻值:15kΩ;精度:±1%;功率:125mW;工作电压:150V;温度系数:±100ppm/℃;; LCSC Part Name: 15kΩ ±1% 125mW 厚膜电阻; Supplier Part: C17475; Manufacturer: UNI-ROYAL(厚声); Supplier Footprint: 0805; JLCPCB Part Class: Basic Part; Datasheet: https://atta.szlcsc.com/upload/public/pdf/source/20200306/C422600_1E6D84923E4A46A82E41ADD87F860B5C.pdf; Supplier: LCSC; Type: 厚膜电阻; Tolerance: ±1%; Power(Watts): 125mW; Voltage-Supply(Max): 150V; Temperature Coefficient: ±100ppm/℃; Operating Temperature: -55℃~+155℃
R118 R119 = 0805W8J0361T5E: 电阻类型:厚膜电阻;阻值:360Ω;精度:±5%;功率:125mW;最大工作电压:150V;温度系数:±100ppm/℃;; LCSC Part Name: 360Ω ±5% 125mW 厚膜电阻; Supplier Part: C25308; Manufacturer: UNI-ROYAL(厚声); Supplier Footprint: 0805; JLCPCB Part Class: Extended Part; Datasheet: https://atta.szlcsc.com/upload/public/pdf/source/20200306/C422600_1E6D84923E4A46A82E41ADD87F860B5C.pdf; Supplier: LCSC; Type: 厚膜电阻; Tolerance: ±5%; Power(Watts): 125mW; Overload Voltage (Max): 150V; Temperature Coefficient: ±100ppm/℃; Operating Temperature Range: -55℃~+155℃
R120 = 0805W8F1200T5E: 电阻类型:厚膜电阻;阻值:120Ω;精度:±1%;功率:125mW;最大工作电压:150V;温度系数:±100ppm/℃;; LCSC Part Name: 120Ω ±1% 125mW 厚膜电阻; Supplier Part: C17437; Manufacturer: UNI-ROYAL(厚声); Supplier Footprint: 0805; JLCPCB Part Class: Basic Part; Datasheet: https://atta.szlcsc.com/upload/public/pdf/source/20200306/C422600_1E6D84923E4A46A82E41ADD87F860B5C.pdf; Supplier: LCSC; Type: 厚膜电阻; Tolerance: ±1%; Power(Watts): 125mW; Overload Voltage (Max): 150V; Temperature Coefficient: ±100ppm/℃; Operating Temperature Range: -55℃~+155℃
R133 = 0805W8F5102T5E: 电阻类型:厚膜电阻;阻值:51kΩ;精度:±1%;功率:125mW;工作电压:150V;温度系数:±100ppm/℃;; LCSC Part Name: 51kΩ ±1% 125mW 厚膜电阻; Supplier Part: C17737; Manufacturer: UNI-ROYAL(厚声); Supplier Footprint: 0805; JLCPCB Part Class: Basic Part; Datasheet: https://item.szlcsc.com/datasheet/0805W8F5102T5E/18425.html; Supplier: LCSC; Type: 厚膜电阻; Tolerance: ±1%; Power(Watts): 125mW; Voltage-Supply(Max): 150V; Temperature Coefficient: ±100ppm/℃; Operating Temperature: -55℃~+155℃
SW13 SW14 = KH-6X6X5H-STM: 电路结构:单刀单掷;按钮形状:圆形按钮;安装方式:立贴;开关长度:6mm;开关宽度:6mm;开关高度:5mm;带支架:不带支架;触点电流:50mA;额定电压:12V;工作寿命:8万次;; LCSC Part Name: 6*6*5mm 立贴 轻触开关; Supplier Part: C2837531; Manufacturer: kinghelm(金航标); Supplier Footprint: SMD-4P,6x6mm; JLCPCB Part Class: 扩展库; Datasheet: https://item.szlcsc.com/datasheet/KH-6X6X5H-STM/3009601.html; Supplier: LCSC; Circuit: 单刀单掷; Actuator Style: 圆形按钮; Mounting Type: 立贴; Length: 6mm; Width: 6mm; Switch Height: 5mm; with Bracket: 不带支架; Contact Current: 50mA; Voltage Rating: 12V; Actuator/Cap Color: 黑色; Termination Style: 鸥翼型; Life: 8万次
U33 U34 U38 U40 U46 = ESD5451N_C2936977: 极性:双向;反向截止电压(Vrwm):5V;钳位电压:13V;峰值脉冲电流(Ipp):5.5A@8/20us;峰值脉冲功率(Ppp):90W@8/20us;击穿电压:8.4V;; LCSC Part Name: 双向ESD 5V截止 峰值浪涌电流：5.5A@8/20us; Supplier Part: C2936977; Manufacturer: TECH PUBLIC(台舟); Supplier Footprint: DFN1006-2(0402); JLCPCB Part Class: 扩展库; Datasheet: https://item.szlcsc.com/datasheet/ESD5451N/3290324.html; Supplier: LCSC; Polarity: 双向; Reverse Stand-Off Voltage (Vrwm): 5V; Clamping Voltage: 13V; Peak Pulse Current (Ipp): 5.5A@8/20us; Peak Pulse Power Dissipation (Ppp): 90W@8/20us; Voltage - Breakdown: 8.4V; Reverse Leakage Current (Ir): 80nA; Number of Channels: 单路; Operating Temperature: -55℃~+125℃; level of protection: IEC 61000-4-2；IEC 61000-4-5; Type: ESD; Junction Capacitance: 12pF
U35 = CH343G: 应用功能:USB转UART;USB协议版本:USB 2.0;通道数:-;数据速率:6Mbps;; LCSC Part Name: USB转高速串口芯片CH343; Supplier Part: C2844153; Manufacturer: WCH(南京沁恒); Supplier Footprint: SOP-16; JLCPCB Part Class: 扩展库; Datasheet: https://item.szlcsc.com/datasheet/CH343G/3034092.html; Supplier: LCSC; Applications Function: USB转UART; USB Protocol: USB 2.0; Voltage - Supply: 3.3V；5V; Data Rate: 6Mbps; Operating Temperature: -40℃~+85℃; Current - Supply: 15mA; Supply Current (Iq): 160uA
U36 = XC6206P332MR_C347376: 输出类型:固定;工作电压:8V;输出电压:3.3V;输出电流:250mA;电源纹波抑制比(PSRR):40dB@(1kHz);输出极性:正极;; LCSC Part Name: 高纹波抑制率、低功耗、低压差 CMOS 降压型电压稳压器; Supplier Part: C347376; Manufacturer: UMW(友台半导体); Supplier Footprint: SOT-23; JLCPCB Part Class: 扩展库; Datasheet: https://item.szlcsc.com/datasheet/XC6206P332MR/324036.html; Supplier: LCSC; Output Type: 固定; Voltage - Supply: 8V; Output Voltage: 3.3V; Output Current: 250mA; Power Supply Rejection Ratio (PSRR): 40dB@(1kHz); Voltage Dropout: 240mV@(50mA); standby current: 7uA; Features: 过流保护；短路保护; Operating Temperature: -25℃~+80℃@(Ta); Output Configuration: 正极; Number of Outputs: 1
U37 = MT9700: 类型:高侧开关;通道数:1;输入控制逻辑:高电平有效;工作电压:2.4V~5.5V;; Supplier Part: C89855; Manufacturer: 西安航天民芯; Supplier Footprint: SOT-23-5; JLCPCB Part Class: 扩展库; Datasheet: https://atta.szlcsc.com/upload/public/pdf/source/20170418/1492481333031.pdf; Supplier: LCSC; Type: 高侧开关; Number of Channels: 1; Control Input Logic: 高电平有效; Voltage - Supply: 2.4V~5.5V; Operating Temperature	-: -40℃~+85℃
U41 = AT8563S_C50341104: Supplier Part: C50341104; Manufacturer: ANALOGT(芯景); JLCPCB Part Class: 扩展库; Supplier: LCSC
U42 = BAT54C_C22466350: 二极管配置:1对共阴极;正向压降(Vf):1V@100mA;直流反向耐压(Vr):30V;整流电流:200mA;; LCSC Part Name: 电压:30V 电流:0.2A; Supplier Part: C22466350; Manufacturer: R+O(宏嘉诚); Supplier Footprint: SOT-23; JLCPCB Part Class: 扩展库; Datasheet: https://item.szlcsc.com/datasheet/BAT54C/24165509.html; Supplier: LCSC; Diode Configuration: 1对共阴极; Voltage - Forward(Vf@If): 1V@100mA; Voltage - DC Reverse(Vr): 30V; Current - Rectified: 200mA; Reverse Leakage Current (Ir): 2uA@25V; Non-Repetitive Peak Forward Surge Current: 600mA
U43 = SP3485EEN(UMW): 类型:收发器;数据速率:12Mbps;; LCSC Part Name: SP3485E 3.3V电源，最多256个节点，12Mbps半双工，RS485/RS422收发器; Supplier Part: C668205; Manufacturer: UMW(友台半导体); Supplier Footprint: SOP-8; JLCPCB Part Class: 扩展库; Datasheet: https://item.szlcsc.com/datasheet/SP3485EEN(UMW)/698053.html; Supplier: LCSC; Type: 收发器; Number of Drivers: 1; Number of Receivers: 1; Voltage - Supply: 2.97V~3.63V; Data Rate: 12Mbps; Number of Nodes: 256; Operating Temperature: -40℃~+85℃; Supply Current (Iq): 520uA; Communication Mode: 半双工
U44 = MBR0520_C5204745: 二极管配置:独立式;正向压降(Vf):440mV@0.5A;直流反向耐压(Vr):20V;整流电流:500mA;; LCSC Part Name: 电压:20V 电流:500mA; Supplier Part: C5204745; Manufacturer: TWGMC(迪嘉); Supplier Footprint: SOD-123; JLCPCB Part Class: 扩展库; Datasheet: https://item.szlcsc.com/datasheet/MBR0520/5894894.html; Supplier: LCSC; Diode Configuration: 独立式; Voltage - Forward(Vf@If): 440mV@0.5A; Voltage - DC Reverse(Vr): 20V; Current - Rectified: 500mA; Reverse Leakage Current (Ir): 150uA; Non-Repetitive Peak Forward Surge Current: 5.5A
USBC6 USBC8 = TYPE-C-31-M-12: 连接器类型:Type-C;协议标准:-;公母:母;安装方式:卧贴;触点数量:16P;端口数量:1;额定电流 - 电源:5A;工作温度:-30℃~+80℃;; LCSC Part Name: Type-C 母 卧贴; Supplier Part: C165948; Manufacturer: 韩国韩荣; Supplier Footprint: SMD; JLCPCB Part Class: Extended Part; Datasheet: https://item.szlcsc.com/datasheet/TYPE-C-31-M-12/177331.html; Supplier: LCSC; Connector Type: Type-C; Gender: 母; Mounting Type: 卧贴; Number of Contacts: 16P; Number of Ports: 1; Current Rating-Power: 5A; Voltage Rating: 20V; Connect-Disconnect Life: 1万次; Length: 7.35mm; Operating Temperature: -30℃~+80℃
X2 = XKXGI-SUA-32.768K: 晶振类型:贴片晶振;频率:32.768kHz;常温频差:±20ppm;负载电容:12.5pF;频率稳定度:±30ppm;; LCSC Part Name: YST310S 32.768KHZ 2P 3215 12.5PF ±20PPM -40~85℃; Supplier Part: C5213671; Manufacturer: YXC(扬兴晶振); Supplier Footprint: SMD3215-2P; JLCPCB Part Class: 扩展库; Datasheet: https://item.szlcsc.com/datasheet/XKXGI-SUA-32.768K/5908943.html; Supplier: LCSC; Type: 贴片晶振; Normal temperature Frequency Tolerance: ±20ppm; Load Capacitance: 12.5pF; Frequency Stability: ±30ppm; Operating Temperature: -40℃~+85℃

## Nets
GND: BAT1.1 C85.2 C86.2 C87.1 C89.1 C90.2 C91.2 C92.1 C94.1 C95.2 C96.2 C97.1 C99.1 C100.2 C101.2 C102.1 C108.2 C109.2 C110.2 C111.1 C112.2 C113.2 C114.1 C115.1 C116.1 C117.1 C118.2 C119.2 C120.1 C121.1 C122.2 C123.1 C124.2 C125.1 C127.1 D9.2 D10.2 D11.2 D13.3 DC3.2 DC3.3 FPC5.11 FPC5.20 FPC5.29 FPC5.41 FPC5.42 LED4.1(C) Q5.2(S) Q6.2(E) Q7.2(E) R93.2 R96.2 R99.2 R103.2 R112.2 R118.2 R121.2 R122.2 R123.2 R124.2 R126.2 R127.2 R133.2 R134.1 R135.1 SW13.3 SW13.4 SW14.3 SW14.4 U27.2(A) U29.1(GND) U30.1(GND) U31.1(GND) U33.2 U34.2 U35.1(GND) U36.1(VSS) U37.2(GND) U38.2 U40.1 U41.4(VSS) U43.5(GND) U45.4 U45.5 U45.8 U45.11 U45.15 U45.21 U45.24 U45.32 U45.52 U45.74 U45.85 U45.96 U45.103 U45.118 U45.123 U45.127 U46.2 USBC6.1(EH) USBC6.2(EH) USBC6.3(EH) USBC6.4(EH) USBC6.A1B12(GND) USBC6.B1A12(GND) USBC8.1(EH) USBC8.2(EH) USBC8.3(EH) USBC8.4(EH) USBC8.A1B12(GND) USBC8.B1A12(GND)
VBAT: BAT1.2 C108.1 U42.1(A)
VCC3V3_CORE: C91.1 C92.2 D9.1 L7.2 R97.1
VCC3V3_SYS: C96.1 C97.2 C124.1 D10.1 L8.2 R100.1 R109.1 R111.1 R113.2 R114.2 R115.1 R116.2 R119.1 R128.2 R129.2 R130.2 R131.2 U42.2(A) U43.8(VCC) U45.1 U45.2 U45.3
VCC5V_SYS: C101.1 C102.2 C117.2 C127.2 D11.1 FPC5.1 FPC5.2 L9.2 R104.1 R110.2 U37.5(VIN)
VCC12V_DCIN: C85.1 C86.1 C87.2 C89.2 C90.1 C94.2 C95.1 C99.2 C100.1 Q4.5(D) R95.1 R98.1 R102.1 U29.3(VIN) U30.3(VIN) U31.3(VIN)
VCC_USBOTG: C118.1 C119.1 U37.1(VOUT) USBC8.A4B9(VBUS) USBC8.B4A9(VBUS)
CH343_D+: U35.5(UD+) USBC6.A6(DP1) USBC6.B6(DP2)
CH343_D-: U35.6(UD-) USBC6.A7(DN1) USBC6.B7(DN2)
CT_INT: C125.2 FPC5.39 R130.1 U45.51
CT_RST: FPC5.35 R131.1 U45.50
FEL: C110.1 SW14.1 SW14.2 U34.1 U45.17
I2C2-SCL: FPC5.38 R128.1 U45.104
I2C2-SDA: FPC5.36 R129.1 U45.105
I2C3-SCL: R113.1 U41.6(SCL) U45.54
I2C3-SDA: R114.1 U41.5(SDA) U45.53
LCD-CLK: FPC5.30 U45.94
LCD-DATA0: FPC5.21 R121.1
LCD-DATA1: FPC5.22 R122.1
LCD-DATA2: FPC5.23 U45.75
LCD-DATA3: FPC5.24 U45.76
LCD-DATA4: FPC5.25 U45.77
LCD-DATA5: FPC5.26 U45.78
LCD-DATA6: FPC5.27 U45.79
LCD-DATA7: FPC5.28 U45.80
LCD-DATA8: FPC5.12 R123.1
LCD-DATA9: FPC5.13 R124.1
LCD-DATA10: FPC5.14 U45.81
LCD-DATA11: FPC5.15 U45.82
LCD-DATA12: FPC5.16 U45.83
LCD-DATA13: FPC5.17 U45.84
LCD-DATA14: FPC5.18 U45.86
LCD-DATA15: FPC5.19 U45.87
LCD-DATA16: FPC5.3 R127.1
LCD-DATA17: FPC5.4 R126.1
LCD-DATA18: FPC5.5 U45.88
LCD-DATA19: FPC5.6 U45.89
LCD-DATA20: FPC5.7 U45.90
LCD-DATA21: FPC5.8 U45.91
LCD-DATA22: FPC5.9 U45.92
LCD-DATA23: FPC5.10 U45.93
LCD-DE: FPC5.33 U45.95
LCD-HSYNC: FPC5.31 U45.73
LCD-VSYNC: FPC5.32 U45.72
LCD_RST: FPC5.40 U45.40
PWM3: FPC5.34 U45.41
PWR_ON: R101.1 R105.1 U45.20
RESET: C109.1 SW13.1 SW13.2 U33.1 U45.19
RS485_1_A: D13.2 P1.1 R119.2 R120.1 U43.6(A)
RS485_1_B: D13.1 P1.2 R118.1 R120.2 U43.7(B)
SPI1-HOLD: R132.1 R133.1 U45.106
UART0_RX: U35.2(TXD) U45.33
UART0_TX: U35.3(RXD) U45.34
UART4_RX: U43.1(RO) U45.48
UART4_TX: R117.1 U43.4(DI) U44.1(K) U45.49
UART_3.3: C112.1 C113.1 C114.2 U35.15(VIO) U36.2(VOUT)
USB0_N: U38.1 U45.121 USBC8.A7(DN1) USBC8.B7(DN2)
USB0_P: U45.122 U46.1 USBC8.A6(DP1) USBC8.B6(DP2)
USB_ID: D12.2(A) Q5.1(G) R111.2 U45.35
VUSB: C115.2 C116.2 U35.7(VBUS) U35.16(VDD5) U36.3(VIN) USBC6.A4B9(VBUS) USBC6.B4A9(VBUS)
$4N231: DC3.1 SW12.1
$4N235: F1.1 SW12.2
$4N505: R91.1 R92.1 U27.1(K)
$4N519: C84.2 F1.2 Q3.2(E) Q4.1(S) Q4.2(S) Q4.3(S) R92.2 U28.1(K)
$4N670: Q3.1(B) R91.2
$4N708: C84.1 Q3.3(C) R93.1 R94.1 U28.2(A)
$4N1099: Q4.4(G) R94.2
$4N1635: R95.2 U29.5(EN)
$4N1770: C88.1 U29.6(BST)
$4N1775: C88.2 L7.1 U29.2(SW)
$4N1855: R96.1 R97.2 U29.4(FB)
$4N2713: R98.2 R101.2 U30.5(EN)
$4N2715: C93.2 L8.1 U30.2(SW)
$4N2720: C93.1 U30.6(BST)
$4N2723: R99.1 R100.2 U30.4(FB)
$4N3207: C98.2 L9.1 U31.2(SW)
$4N3212: R103.1 R104.2 U31.4(FB)
$4N3243: C98.1 U31.6(BST)
$4N3246: R102.2 R105.2 U31.5(EN)
$4N4522: LED4.2(A) R109.2
$5N1142: C111.2 U35.4(V3)
$5N3847: Q5.3(D) R110.1 U37.4(EN)
$5N4121: R112.1 U37.3(SET)
$5N5803: C121.2 U41.2(OSCO) X2.1(OSC1)
$5N5809: C120.2 U41.1(OSCI) X2.2(OSC2)
$5N5973: C122.1 U41.8(VDD) U42.3(K)
$5N6294: LED5.2(A) R115.2
$5N6323: LED5.1(C) Q7.3(C)
$5N6452: Q6.3(C) R116.1 U43.2(#RE) U43.3(DE)
$5N6688: C123.2 Q6.1(B) R117.2 U44.2(A)
$5N10229: Q7.1(B) R132.2
$5N12236: R134.2 USBC6.A5(CC1)
$5N12273: R135.2 USBC6.B5(CC2)
$5N12607: D12.1(K) U40.2 USBC8.A5(CC1) USBC8.B5(CC2)

Not connected (* = marked no-connect by the designer): FPC5 37*; SCREW1 1; SCREW2 1; SCREW3 1; SCREW4 1; SCREW5 1; SCREW6 1; SW12 3*; U35 8(ACT#)* 9(DCD)* 10(DTR)* 11(RTS)* 12(DSR)* 13(CTS)* 14(RI)*; U41 3(INT#)* 7(CLKOUT)*; U45 6* 7* 9* 10* 12* 13* 14* 16* 18* 22* 23* 25* 26* 27* 28* 29* 30* 31* 36* 37* 38* 39* 42* 43* 44* 45* 46* 47* 55* 56* 57* 58* 59* 60* 61* 62* 63* 64* 65* 66* 67* 68* 69* 70* 71* 97* 98* 99* 100* 101* 102* 107* 108* 109* 110* 111* 112* 113* 114* 115* 116* 117* 119* 120* 124* 125* 126* 128* 129* 130* 131* 132* 133* 134* 135* 136* 137* 138* 139* 140*; USBC6 A8(SBU1)* B8(SBU2)*; USBC8 A8(SBU1)* B8(SBU2)*

## Notes on the sheets
sheet 1
- RGB LCD
sheet 3
- RTC
- USB-TTL
- UPDATE&RESET
- RS485
- USB-OTG
